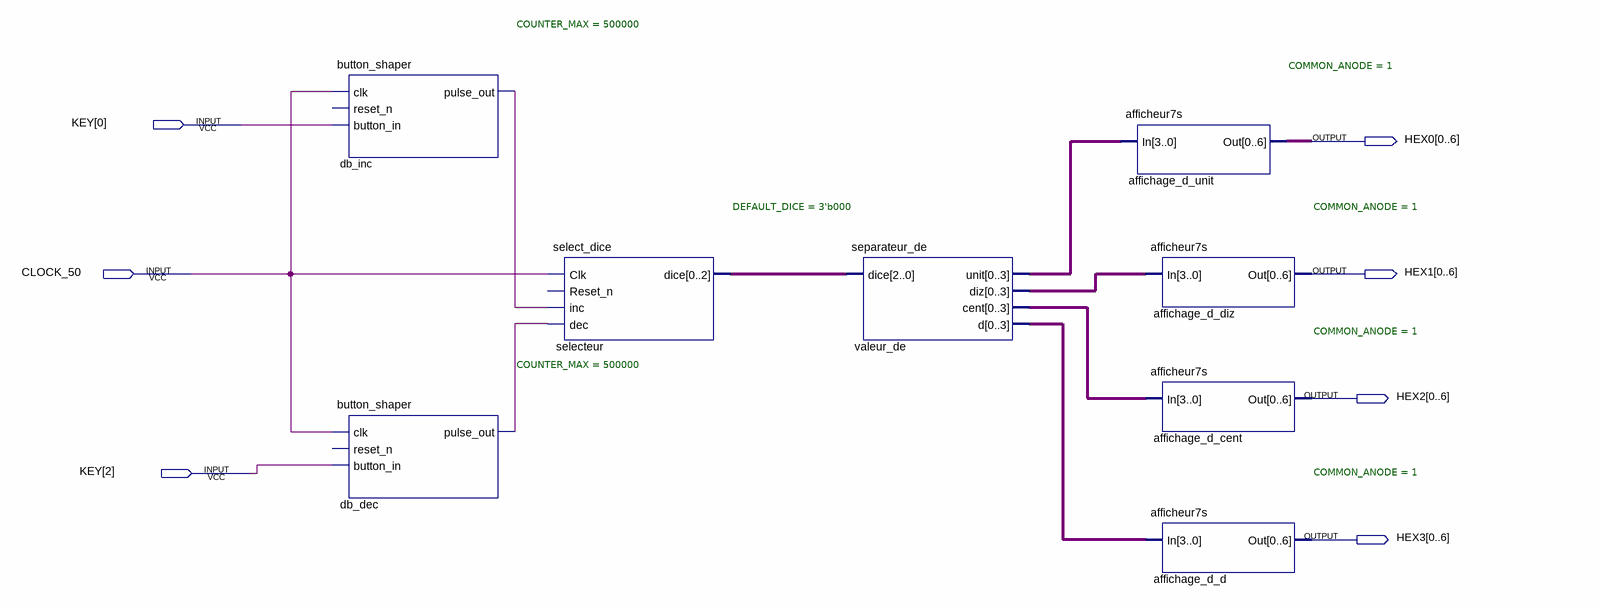
[diagram p0: schematic sheet]
// Quartus schematic Block1.bdf as structural Verilog: 8 symbols, 7 pins
module Block1 (
  input  [2:0] KEY,
  input  CLOCK_50,
  output [0:6] HEX0,
  output [0:6] HEX1,
  output [0:6] HEX2,
  output [0:6] HEX3
);

  wire db_dec_pulse_out, db_inc_pulse_out;
  wire [2:0] selecteur_dice;
  wire [3:0] valeur_de_cent, valeur_de_d, valeur_de_diz, valeur_de_unit;

  button_shaper #(.COUNTER_MAX(500000)) db_inc (
    .clk(CLOCK_50), .button_in(KEY[0]), .pulse_out(db_inc_pulse_out));  // open: reset_n
  button_shaper #(.COUNTER_MAX(500000)) db_dec (
    .clk(CLOCK_50), .button_in(KEY[2]), .pulse_out(db_dec_pulse_out));  // open: reset_n
  select_dice #(.DEFAULT_DICE(3'b000)) selecteur (
    .Clk(CLOCK_50), .inc(db_inc_pulse_out), .dec(db_dec_pulse_out), .dice(selecteur_dice));  // open: Reset_n
  separateur_de valeur_de (
    .dice(selecteur_dice), .unit(valeur_de_unit), .diz(valeur_de_diz), .cent(valeur_de_cent), .d(valeur_de_d));
  afficheur7s #(.COMMON_ANODE(1)) affichage_d_unit (.In(valeur_de_unit), .Out(HEX0));
  afficheur7s #(.COMMON_ANODE(1)) affichage_d_diz (.In(valeur_de_diz), .Out(HEX1));
  afficheur7s #(.COMMON_ANODE(1)) affichage_d_cent (.In(valeur_de_cent));  // open: Out
  afficheur7s #(.COMMON_ANODE(1)) affichage_d_d (.In(valeur_de_d));  // open: Out
endmodule
